# Altium project timer.PrjPcb
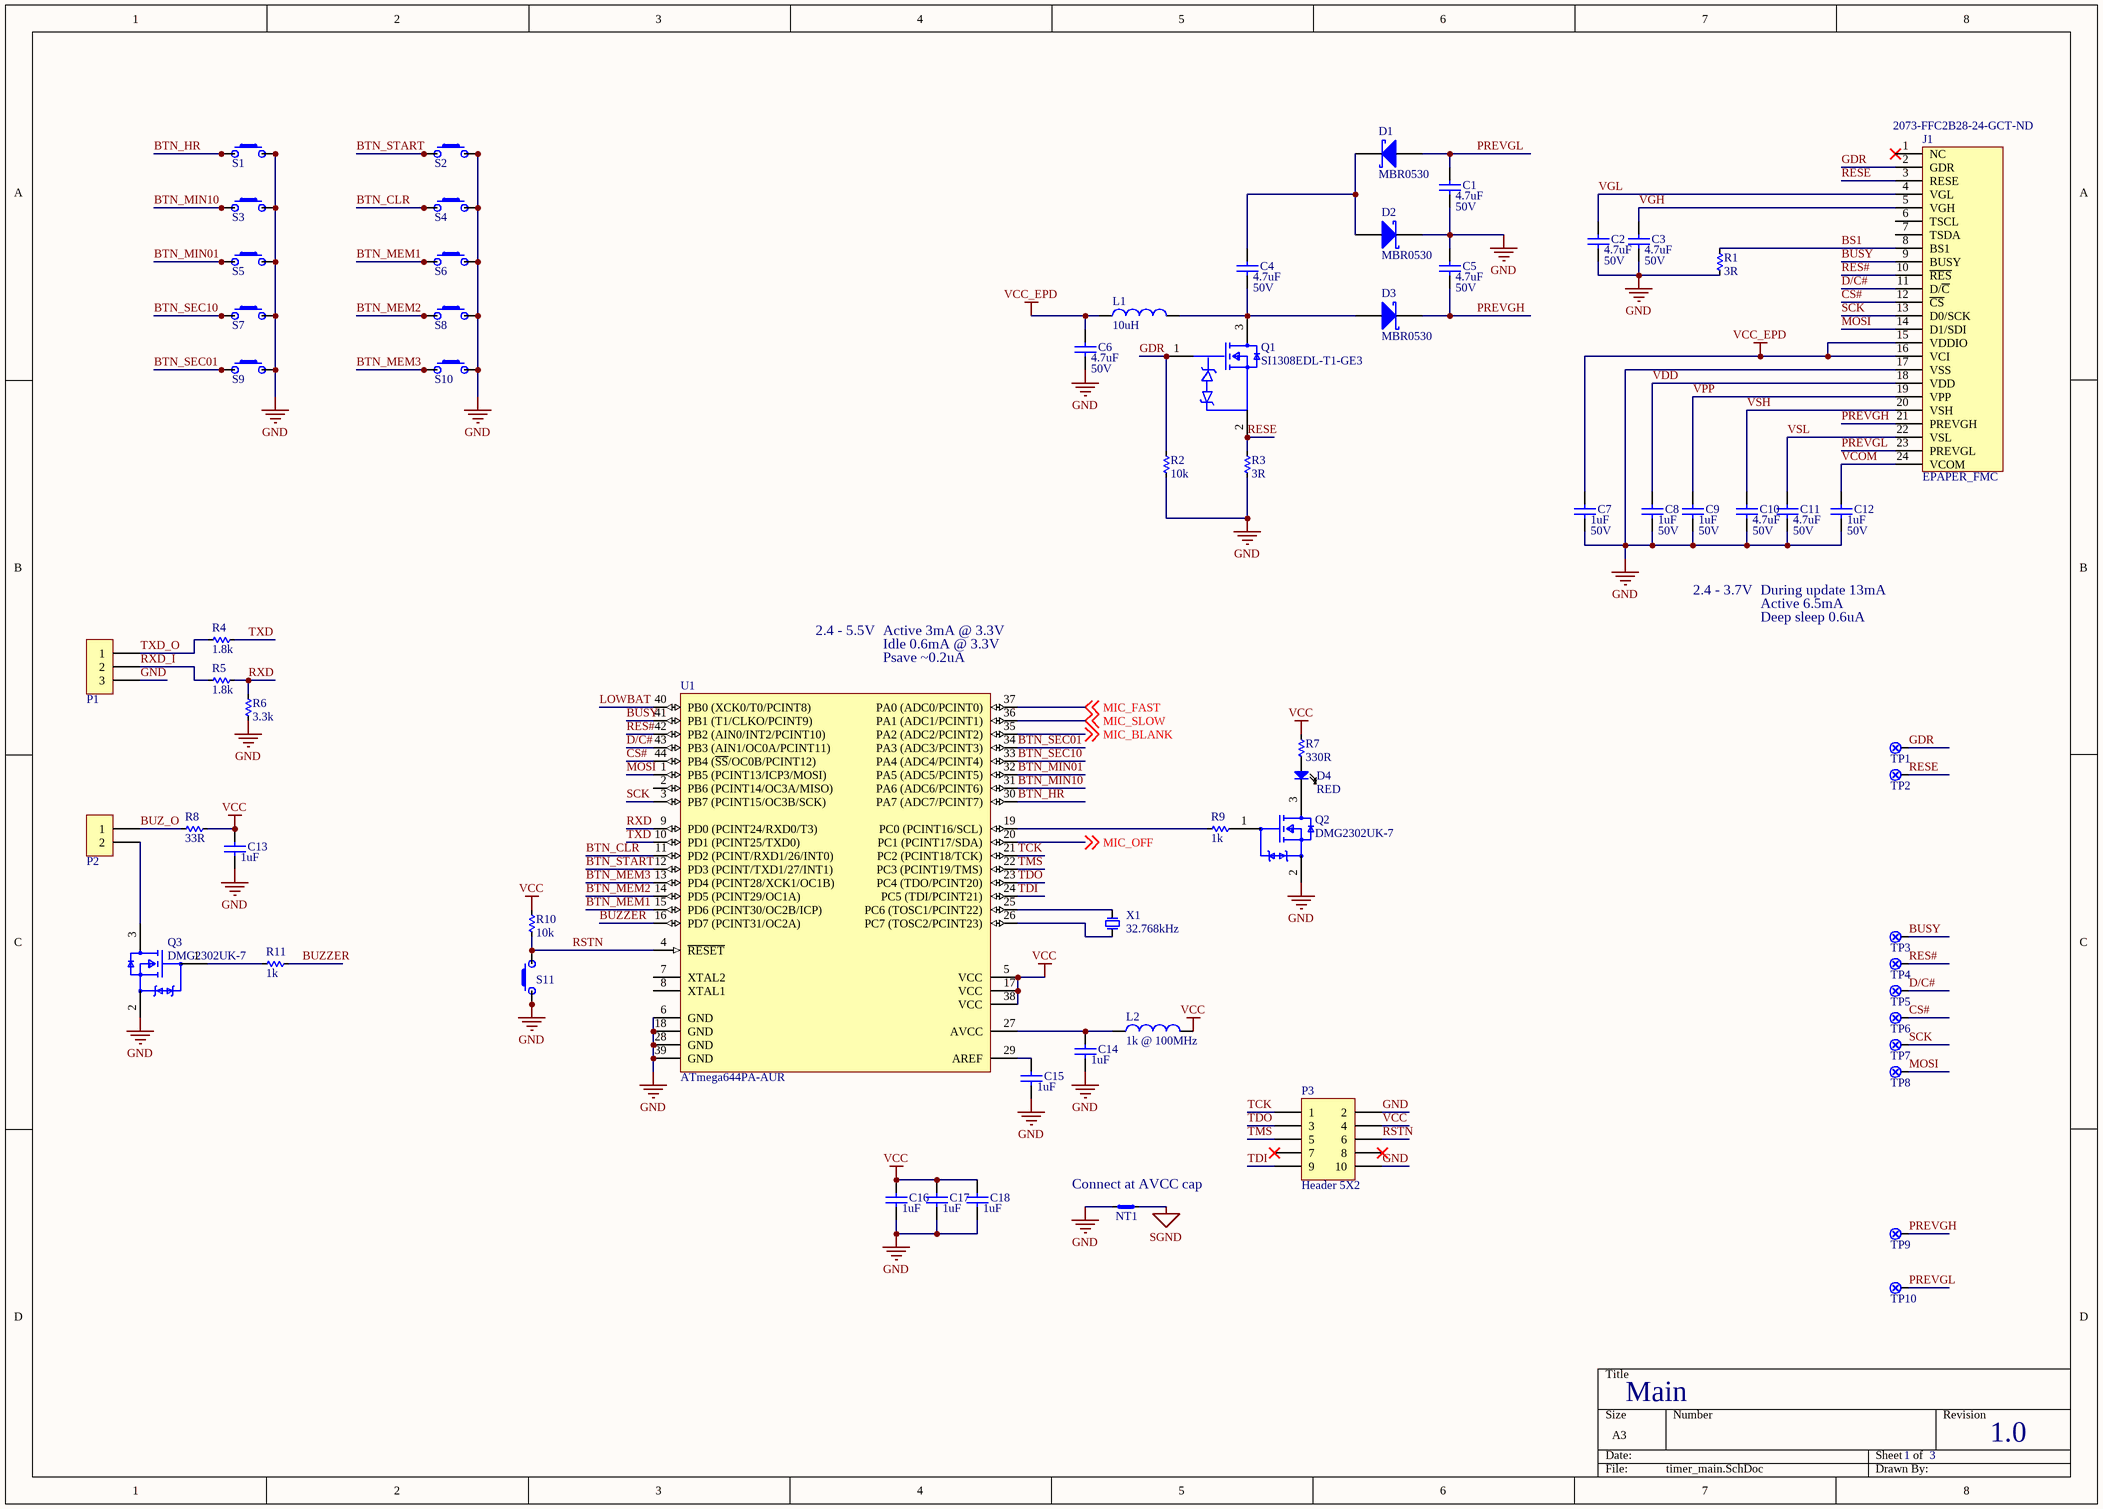
[diagram p0: timer_main.SchDoc]
Version: 1.0
3 sheets, 158 parts. Net scope: global (net labels, ports and power ports of the same name join across sheets).
Board file: timer.PcbDoc
Sheets:
  timer_main.SchDoc
  timer_power.SchDoc
  timer_mic.SchDoc

## Sheet timer_main.SchDoc
size A3; DocumentNumber: 1; SheetNumber: 1; SheetTotal: 3

### Parts
C1  value 4.7uF  Voltage: 50V  [C0805/2012]  (hidden comment: CAP)
C2  value 4.7uF  Voltage: 50V  [C0805/2012]  (hidden comment: CAP)
C3  value 4.7uF  Voltage: 50V  [C0805/2012]  (hidden comment: CAP)
C4  value 4.7uF  Voltage: 50V  [C0805/2012]  (hidden comment: CAP)
C5  value 4.7uF  Voltage: 50V  [C0805/2012]  (hidden comment: CAP)
C6  value 4.7uF  Voltage: 50V  [C0805/2012]  (hidden comment: CAP)
C7  value 1uF  Voltage: 50V  [C0603/1608]  (hidden comment: CAP)
C8  value 1uF  Voltage: 50V  [C0603/1608]  (hidden comment: CAP)
C9  value 1uF  Voltage: 50V  [C0603/1608]  (hidden comment: CAP)
C10  value 4.7uF  Voltage: 50V  [C0805/2012]  (hidden comment: CAP)
C11  value 4.7uF  Voltage: 50V  [C0805/2012]  (hidden comment: CAP)
C12  value 1uF  Voltage: 50V  [C0603/1608]  (hidden comment: CAP)
C13  value 1uF  [C0603/1608]  (hidden comment: CAP)
C14  value 1uF  [C0603/1608]  (hidden comment: CAP)
C15  value 1uF  [C0603/1608]  (hidden comment: CAP)
C16  value 1uF  [C0603/1608]  (hidden comment: CAP)
C17  value 1uF  [C0603/1608]  (hidden comment: CAP)
C18  value 1uF  [C0603/1608]  (hidden comment: CAP)
D1  MBR0530  [FAIR-SOD123-2_V]
D2  MBR0530  [FAIR-SOD123-2_V]
D3  MBR0530  [FAIR-SOD123-2_V]
D4  value RED  [0603/1608_P]  (hidden comment: LED)
J1  EPAPER_FMC  Supplier Part Number 1: 2073-FFC2B28-24-GCT-ND  [FFC2B28-24-G REV]
L1  value 10uH  [IND4x4mm]  (hidden comment: IND)
L2  value 1k @ 100MHz  [R0603/1608]  (hidden comment: FERRITE)
NT1  NET_TIE2  [NT2_0.5mm]  (value not drawn)  (net tie, no BOM)
P1  SIL3  [PINS-3]  (value not drawn)
P2  SIL2  [PINS-2]  (value not drawn)
P3  Header 5X2  [HDR2X5]
Q1  SI1308EDL-T1-GE3  [FP-S-03946-MFG]
Q2  DMG2302UK-7  [FP-SOT23-MFG]
Q3  DMG2302UK-7  [FP-SOT23-MFG]
R1  value 3R  [R0603/1608]  (hidden comment: RES)
R2  value 10k  [R0603/1608]  (hidden comment: RES)
R3  value 3R  [R0603/1608]  (hidden comment: RES)
R4  value 1.8k  [R0603/1608]  (hidden comment: RES)
R5  value 1.8k  [R0603/1608]  (hidden comment: RES)
R6  value 3.3k  [R0603/1608]  (hidden comment: RES)
R7  value 330R  [R0603/1608]  (hidden comment: RES)
R8  value 33R  [R0603/1608]  (hidden comment: RES)
R9  value 1k  [R0603/1608]  (hidden comment: RES)
R10  value 10k  [R0603/1608]  (hidden comment: RES)
R11  value 1k  [R0603/1608]  (hidden comment: RES)
S1  SW  [SW-PTS645-SMT]  (value not drawn)
S2  SW  [SW-PTS645-SMT]  (value not drawn)
S3  SW  [SW-PTS645-SMT]  (value not drawn)
S4  SW  [SW-PTS645-SMT]  (value not drawn)
S5  SW  [SW-PTS645-SMT]  (value not drawn)
S6  SW  [SW-PTS645-SMT]  (value not drawn)
S7  SW  [SW-PTS645-SMT]  (value not drawn)
S8  SW  [SW-PTS645-SMT]  (value not drawn)
S9  SW  [SW-PTS645-SMT]  (value not drawn)
S10  SW  [SW-PTS645-SMT]  (value not drawn)
S11  SW  [SW-PTS645-SMT]  (value not drawn)
TP1  TP  [TP-1.0]  (value not drawn)  (no BOM)
TP2  TP  [TP-1.0]  (value not drawn)  (no BOM)
TP3  TP  [TP-1.0]  (value not drawn)  (no BOM)
TP4  TP  [TP-1.0]  (value not drawn)  (no BOM)
TP5  TP  [TP-1.0]  (value not drawn)  (no BOM)
TP6  TP  [TP-1.0]  (value not drawn)  (no BOM)
TP7  TP  [TP-1.0]  (value not drawn)  (no BOM)
TP8  TP  [TP-1.0]  (value not drawn)  (no BOM)
TP9  TP  [TP-1.0]  (value not drawn)  (no BOM)
TP10  TP  [TP-1.0]  (value not drawn)  (no BOM)
U1  ATmega644PA-AUR  [44A_N]
X1  value 32.768kHz  [CMR200T]  (hidden comment: XTAL)

### Nets
GND: C1.1 C2.1 C3.1 C5.2 C6.1 C7.1 C8.1 C9.1 C10.1 C11.1 C12.1 C13.1 C14.1 C15.1 C16.1 C17.1 C18.1 D2.2(K) J1.17(VSS) NT1.1 P1.3 P3.2 P3.10 Q2.2(S) Q3.2(S) R1.2 R2.2 R3.2 R6.2 S1.3 S1.4 S2.3 S2.4 S3.3 S3.4 S4.3 S4.4 S5.3 S5.4 S6.3 S6.4 S7.3 S7.4 S8.3 S8.4 S9.3 S9.4 S10.3 S10.4 S11.1 S11.2 U1.6(GND) U1.18(GND) U1.28(GND) U1.39(GND)
SGND: NT1.2
VCC: C13.2 C16.2 C17.2 C18.2 L2.2 P3.4 R7.1 R8.2 R10.1 U1.5(VCC) U1.17(VCC) U1.38(VCC)
VCC_EPD: C6.2 C7.2 J1.15(VDDIO) J1.16(VCI) L1.1
BS1: J1.8(BS1) R1.1
BTN_CLR: S4.1 S4.2 U1.11(PD2_(PCINT/RXD1/26/INT0))
BTN_HR: S1.1 S1.2 U1.30(PA7_(ADC7/PCINT7))
BTN_MEM1: S6.1 S6.2 U1.15(PD6_(PCINT30/OC2B/ICP))
BTN_MEM2: S8.1 S8.2 U1.14(PD5_(PCINT29/OC1A))
BTN_MEM3: S10.1 S10.2 U1.13(PD4_(PCINT28/XCK1/OC1B))
BTN_MIN01: S5.1 S5.2 U1.32(PA5_(ADC5/PCINT5))
BTN_MIN10: S3.1 S3.2 U1.31(PA6_(ADC6/PCINT6))
BTN_SEC01: S9.1 S9.2 U1.34(PA3_(ADC3/PCINT3))
BTN_SEC10: S7.1 S7.2 U1.33(PA4_(ADC4/PCINT4))
BTN_START: S2.1 S2.2 U1.12(PD3_(PCINT/TXD1/27/INT1))
BUSY: J1.9(BUSY) TP3.0 U1.41(PB1_(T1/CLKO/PCINT9))
BUZ_O: P2.1 R8.1
BUZZER: R11.2 U1.16(PD7_(PCINT31/OC2A))
CS#: J1.12(~{CS}) TP6.0 U1.44(PB4_(~{SS}/OC0B/PCINT12))
D/C#: J1.11(D/~{C}) TP5.0 U1.43(PB3_(AIN1/OC0A/PCINT11))
GDR: J1.2(GDR) Q1.1(G) R2.1 TP1.0
LOWBAT: U1.40(PB0_(XCK0/T0/PCINT8))
MIC_BLANK: U1.35(PA2_(ADC2/PCINT2)) ; off-sheet MIC_BLANK
MIC_FAST: U1.37(PA0_(ADC0/PCINT0)) ; off-sheet MIC_FAST
MIC_OFF: U1.20(PC1_(PCINT17/SDA)) ; off-sheet MIC_OFF
MIC_SLOW: U1.36(PA1_(ADC1/PCINT1)) ; off-sheet MIC_SLOW
MOSI: J1.14(D1/SDI) TP8.0 U1.1(PB5_(PCINT13/ICP3/MOSI))
PREVGH: C5.1 D3.2(K) J1.21(PREVGH) TP9.0
PREVGL: C1.2 D1.1(A) J1.23(PREVGL) TP10.0
RES#: J1.10(~{RES}) TP4.0 U1.42(PB2_(AIN0/INT2/PCINT10))
RESE: J1.3(RESE) Q1.2(S) R3.1 TP2.0
RSTN: P3.6 R10.2 S11.3 S11.4 U1.4(~{RESET})
RXD: R5.2 R6.1 U1.9(PD0_(PCINT24/RXD0/T3))
RXD_I: P1.2 R5.1
SCK: J1.13(D0/SCK) TP7.0 U1.3(PB7_(PCINT15/OC3B/SCK))
TCK: P3.1 U1.21(PC2_(PCINT18/TCK))
TDI: P3.9 U1.24(PC5_(TDI/PCINT21))
TDO: P3.3 U1.23(PC4_(TDO/PCINT20))
TMS: P3.5 U1.22(PC3_(PCINT19/TMS))
TXD: R4.2 U1.10(PD1_(PCINT25/TXD0))
TXD_O: P1.1 R4.1
VCOM: C12.2 J1.24(VCOM)
VDD: C8.2 J1.18(VDD)
VGH: C3.2 J1.5(VGH)
VGL: C2.2 J1.4(VGL)
VPP: C9.2 J1.19(VPP)
VSH: C10.2 J1.20(VSH)
VSL: C11.2 J1.22(VSL)
NetC4_1: C4.1 D3.1(A) L1.2 Q1.3(D)
NetC4_2: C4.2 D1.2(K) D2.1(A)
NetC14_2: C14.2 L2.1 U1.27(AVCC)
NetC15_2: C15.2 U1.29(AREF)
NetD4_1: D4.1 R7.2
NetD4_2: D4.2 Q2.3(D)
NetP2_2: P2.2 Q3.3(D)
NetQ2_1: Q2.1(G) R9.2
NetQ3_1: Q3.1(G) R11.1
NetR9_1: R9.1 U1.19(PC0_(PCINT16/SCL))
NetU1_25: U1.25(PC6_(TOSC1/PCINT22)) X1.2
NetU1_26: U1.26(PC7_(TOSC2/PCINT23)) X1.1

Not connected (* = marked no-connect by the designer): J1 1(NC)* 6(TSCL) 7(TSDA); P3 7* 8*; U1 2(PB6_(PCINT14/OC3A/MISO)) 7(XTAL2) 8(XTAL1)

### Notes on the sheet
- 2.4 - 5.5V
- Active 3mA @ 3.3V
- Idle 0.6mA @ 3.3V
- 2.4 - 3.7V
- Active 6.5mA
- Deep sleep 0.6uA
- During update 13mA
- (near U1) Psave ~0.2uA
- (near NT1) Connect at AVCC cap
- Main

### Library data of the parts
C1-C12 = CAP: Capacitor; Tolerance: x%; Type: X5R/X7R
C13-C18 = CAP: Capacitor; Tolerance: x%; Voltage: 6.3V; Type: X5R/X7R
D1-D3 = CMP-2000-05113-1: Diode Schottky 30V 0.5A 2-Pin SOD-123 T/R; Manufacturer: Fairchild; Speed: FastRecovery=200mA(Io); Voltage - Forward (Vf) (Max) @ If: 430mV@500mA; Online Catalog: SchottkyDiode; Current - Reverse Leakage @ Vr: 130µA@30V; Current - Average Rectified (Io): 500mA; Other Names: MBR0530CT; Reverse Recovery Time (trr): -; Category: DiscreteSemiconductorProducts; Package / Case: SOD-123; Capacitance @ Vr, F: -; Operating Temperature - Junction: -65degC~125degC; Standard Package: 1; Packaging: CutTape(CT); Family: Diodes,Rectifiers-Single; Diode Type: Schottky; Series: -; Datasheet Version: Rev. 1.1.0, 10/2014; Supplier Device Package: SOD-123; Mounting Type: SurfaceMount; Datasheet URL: https://www.fairchildsemi.com/datasheets/MB/MBR0530.pdf; Manufacturer URL: https://www.fairchildsemi.com/; Voltage - DC Reverse (Vr) (Max): 30V
J1 = EPAPER_FMC: FMC connector for epaper display from Dailan Good Display; Supplier 1: Digi-Key
L1 L2 = IND: Inductor
NT1 = NET_TIE2: Link between nets
P1 = SIL3: SIL package, 3 pins
P2 = SIL2: SIL package, 2 pins
P3 = Header 5X2: Header, 5-Pin, Dual row; LatestRevisionDate: 17-Jul-2002; LatestRevisionNote: Re-released for DXP Platform.; Publisher: Altium Limited
Q1 = CMP-02550-000099-1: MOSFET N-CH 30V 1.4A SC-70-3; Manufacturer: Vishay; Threshold Vgs Max: 1.5V; Turn On Delay Time: 2ns; Gate Charge At Vgs: 2.7nC @ 10V; Typ Forward Diode Voltage: 0.8V; Gate To Source Voltage: 12V; Max Junction Temp: +150°C; Pulse Drain Current: 6A; Threshold Vgs Min: 0.6V; Number Of Channels: 1; Transconductance: 5S; Continuous Drain Current: 1.5A; Rthja Max: 250°C/W; Turn Off Delay Time: 8ns; Power Dissipation: 0.4W; Input Capacitace At Vds: 105pF @ 15V; Max Forward Diode Voltage: 1.2V; Reverse Recovery Charge: 3nC; Depletion Mode: False; Drain To Source Resistance: 0.11Ω; Height: 1.1mm; Lead Free: Yes; Ipc Land Pattern Name: SOT65P210X100-3; Drain To Source Voltage: 30V; Mouser Description: MOSFET 30V 1.5A; Temperature Range Low: -55°C; ComponentLink2URL: http://www.vishay.com/docs/63399/si1308edl.pdf; Package: S-03946; RoHS: TRUE; Device Class L1: Discrete Semiconductors; Manufacturer Part Number: SI1308EDL-T1-GE3; Category: Trans; Number Of N Channels: 1; Temperature Range High: +150°C; Octopart: https://octopart.com/si1308edl-t1-ge3-vishay-45284459; Automotive: No; Digikey Description: MOSFET N-CH 30V 1.4A SC-70-3; ComponentLink2Description: Datasheet; Device Class L3: MOSFETs; Reverse Recovery Time: 8ns; Device Class L2: Transistors; Drain To Source Breakdown Voltage: 30V; Temperature: -55°C to +150°C
Q2 Q3 = CMP-12801-000001-1: MOSFET N-CH 20V 2.8A SOT23; Manufacturer: Diodes Inc.; Reverse Recovery Time: 5.3ns; Gate Charge At Vgs: 2.8nC @ 10V; Turn On Delay Time: 0.6ns; Pulse Drain Current: 12A; Max Forward Diode Voltage: 1.2V; Reverse Recovery Charge: 0.5nC; Automotive Grade: Grade 0; Threshold Vgs Min: 0.3V; Number Of N Channels: 1; Standoff Height: 0.013mm; Typ Forward Diode Voltage: 0.7V; Drain To Source Resistance: 61mΩ; Rthja Max: 192°C/W; Max Junction Temp: +150°C; Input Capacitace At Vds: 130pF @ 10V; Threshold Vgs Max: 1V; Turn Off Delay Time: 4.2ns; Depletion Mode: False; Gate To Source Voltage: 12V; Power Dissipation: 0.66W; Device Class L1: Discrete Semiconductors; Footprint Url: https://www.diodes.com/assets/Package-Files/SOT23.pdf; Lead Free: Yes; Manufacturer Part Number: DMG2302UK-7; Temperature Range High: +150°C; Drain To Source Voltage: 20V; Category: Trans; Digikey Description: MOSFET N-CH 20V 2.8A SOT23; RoHS: TRUE; Device Class L2: Transistors; Height: 1.1mm; Automotive: Yes; Package: SOT23; Drain To Source Breakdown Voltage: 20V; Continuous Drain Current: 2.8A; ComponentLink2Description: Datasheet; Device Class L3: MOSFETs; Octopart: https://octopart.com/dmg2302uk-7-diodes+inc.-73850182; Temperature Range Low: -55°C; Temperature: -55°C to +150°C; Number Of Channels: 1; ComponentLink2URL: https://www.diodes.com/assets/Datasheets/DMG2302UK.pdf
R1-R11 = RES: Resistor; Tolerance: x%
S1-S11 = SW-PB: Switch; Supplier 1: Digi-Key; Supplier Part Number 1: CKN9088CT-ND
TP1-TP10 = TP: Test point
U1 = CMP-0095-00266-2: 8-bit AVR Microcontroller, 64KB Flash, 2KB EEPROM, 4KB SRAM, 44-pin TQFP, Industrial Grade (-40°C to 85°C), Reel; ComponentLink3URL: http://www.atmel.com/dyn/resources/prod_documents/8272S.pdf; ComponentLink2Description: ATmega164A/164PA/324A/324PA/644A/644PA/1284/1284P Datasheet; ComponentLink2URL: http://www.atmel.com/dyn/resources/prod_documents/doc8272.pdf; PackageVersion: revC, Oct-2010; Code_JEDEC: MS-026-ACB; DatasheetVersion: revC, Jun-2011; PackageDescription: 44-Pin Plastic Thin Profile Quad Flat Pack, 10 x 10 x 1.0 mm Body, 0.8 mm Pitch (TQFP); ComponentLink1URL: http://www.atmel.com/; PackageReference: 44A; ComponentLink3Description: ATmega164A/164PA/324A/324PA/644A/644PA/1284/1284P Summary; ComponentLink1Description: Manufacturer URL; RevisionNote: DatasheetVersion & PackageVersion updated. Sch pin names updated. URLs added.
X1 = XTAL: Crystal

## Sheet timer_power.SchDoc
size A3; DocumentNumber: 2; SheetNumber: 2; SheetTotal: 3
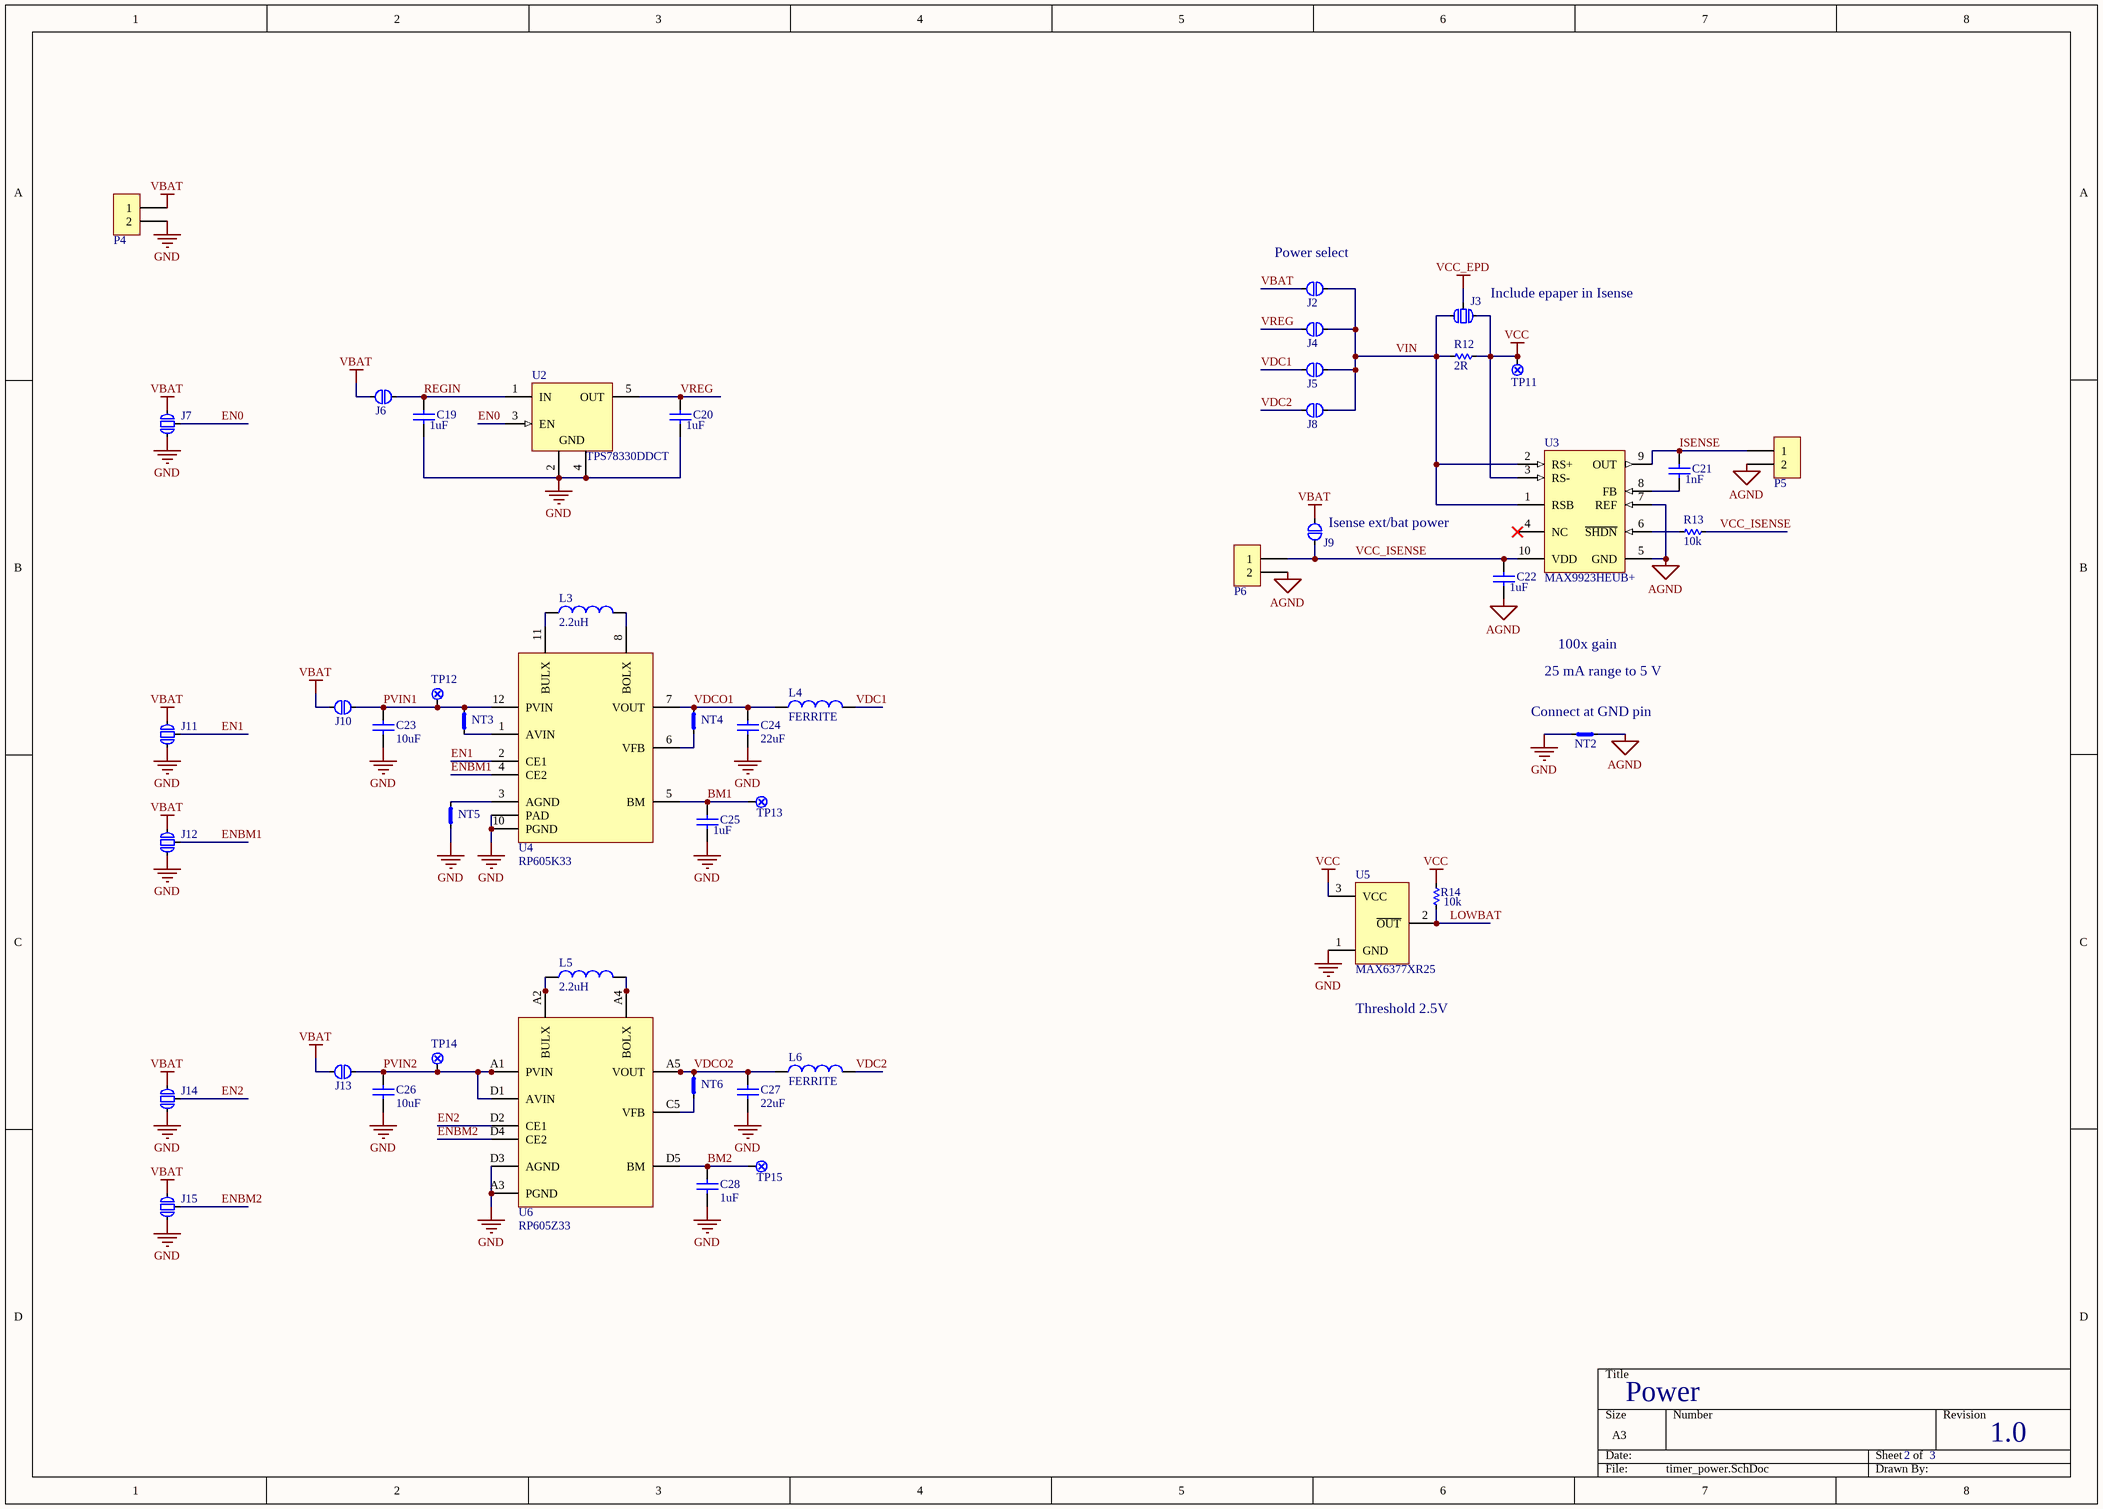
[diagram p1: timer_power.SchDoc]

### Parts
C19  value 1uF  [C0603/1608]  (hidden comment: CAP)
C20  value 1uF  [C0603/1608]  (hidden comment: CAP)
C21  value 1nF  [C0603/1608]  (hidden comment: CAP)
C22  value 1uF  [C0603/1608]  (hidden comment: CAP)
C23  value 10uF  [C0805/2012]  (hidden comment: CAP)
C24  value 22uF  [C0805/2012]  (hidden comment: CAP)
C25  value 1uF  [C0603/1608]  (hidden comment: CAP)
C26  value 10uF  [C0805/2012]  (hidden comment: CAP)
C27  value 22uF  [C0805/2012]  (hidden comment: CAP)
C28  value 1uF  [C0603/1608]  (hidden comment: CAP)
J2  SEL2  [JMP2]  (value not drawn)  (no BOM)
J3  SEL3  [JMP3]  (value not drawn)  (no BOM)
J4  SEL2  [JMP2]  (value not drawn)  (no BOM)
J5  SEL2  [JMP2]  (value not drawn)  (no BOM)
J6  SEL2  [JMP2]  (value not drawn)  (no BOM)
J7  SEL3  [JMP3]  (value not drawn)  (no BOM)
J8  SEL2  [JMP2]  (value not drawn)  (no BOM)
J9  SEL2  [JMP2]  (value not drawn)  (no BOM)
J10  SEL2  [JMP2]  (value not drawn)  (no BOM)
J11  SEL3  [JMP3]  (value not drawn)  (no BOM)
J12  SEL3  [JMP3]  (value not drawn)  (no BOM)
J13  SEL2  [JMP2]  (value not drawn)  (no BOM)
J14  SEL3  [JMP3]  (value not drawn)  (no BOM)
J15  SEL3  [JMP3]  (value not drawn)  (no BOM)
L3  value 2.2uH  [IND3x3mm]  (hidden comment: IND)
L4  value FERRITE  [R0603/1608]  (hidden comment: IND)
L5  value 2.2uH  [IND3x3mm]  (hidden comment: IND)
L6  value FERRITE  [R0603/1608]  (hidden comment: IND)
NT2  NET_TIE  [NT2_0.5mm]  (value not drawn)  (net tie, no BOM)
NT3  NET_TIE  [NT2_0.5mm]  (value not drawn)  (net tie, no BOM)
NT4  NET_TIE  [NT2_0.5mm]  (value not drawn)  (net tie, no BOM)
NT5  NET_TIE  [NT2_0.5mm]  (value not drawn)  (net tie, no BOM)
NT6  NET_TIE  [NT2_0.5mm]  (value not drawn)  (net tie, no BOM)
P4  SIL2  [PINS-2]  (value not drawn)
P5  SIL2  [PINS-2]  (value not drawn)
P6  SIL2  [PINS-2]  (value not drawn)
R12  value 2R  [R0805/2012]  (hidden comment: RES)
R13  value 10k  [R0603/1608]  (hidden comment: RES)
R14  value 10k  [R0603/1608]  (hidden comment: RES)
TP11  TP  [TP-1.0]  (value not drawn)  (no BOM)
TP12  TP  [TP-1.0]  (value not drawn)  (no BOM)
TP13  TP  [TP-1.0]  (value not drawn)  (no BOM)
TP14  TP  [TP-1.0]  (value not drawn)  (no BOM)
TP15  TP  [TP-1.0]  (value not drawn)  (no BOM)
U2  TPS78330DDCT  [DDC0005A_L]
U3  MAX9923HEUB+  [MAXM-U10+2_N]
U4  RP605K33  [DFN(PLP)2730-12]
U5  MAX6377XR25  [SC70-3]
U6  RP605Z33  [WLCSP-20-P3]

### Nets
AGND: C22.1 NT2.2 P5.2 P6.2 U3.5(GND) U3.7(REF)
GND: C19.1 C20.1 C23.1 C24.1 C25.1 C26.1 C27.1 C28.1 J7.1 J11.1 J12.1 J14.1 J15.1 NT2.1 NT5.1 P4.2 U2.2(GND) U2.4(GND) U4.0(PAD) U4.9(PGND) U4.10(PGND) U5.1(GND) U6.A3(PGND) U6.B3(PGND) U6.C3(PGND) U6.D3(AGND)
VBAT: J2.1 J6.1 J7.3 J9.2 J10.1 J11.3 J12.3 J13.1 J14.3 J15.3 P4.1
VCC: J3.1 R12.2 R14.1 TP11.0 U3.3(RS-) U5.3(VCC)
VCC_EPD: J3.2
BM1: C25.2 TP13.0 U4.5(BM)
BM2: C28.2 TP15.0 U6.D5(BM)
EN0: J7.2 U2.3(EN)
EN1: J11.2 U4.2(CE1)
EN2: J14.2 U6.D2(CE1)
ENBM1: J12.2 U4.4(CE2)
ENBM2: J15.2 U6.D4(CE2)
ISENSE: C21.2 P5.1 U3.9(OUT)
LOWBAT: R14.2 U5.2(~{OUT})
PVIN1: C23.2 J10.2 NT3.2 TP12.0 U4.12(PVIN)
PVIN2: C26.2 J13.2 TP14.0 U6.A1(PVIN) U6.B1(PVIN) U6.C1(PVIN) U6.D1(AVIN)
REGIN: C19.2 J6.2 U2.1(IN)
VCC_ISENSE: C22.2 J9.1 P6.1 R13.2 U3.10(VDD)
VDC1: J5.1 L4.2
VDC2: J8.1 L6.2
VDCO1: C24.2 L4.1 NT4.2 U4.7(VOUT)
VDCO2: C27.2 L6.1 NT6.2 U6.A5(VOUT) U6.B5(VOUT)
VIN: J2.2 J3.3 J4.2 J5.2 J8.2 R12.1 U3.1(RSB) U3.2(RS+)
VREG: C20.2 J4.1 U2.5(OUT)
NetC21_1: C21.1 U3.8(FB)
NetL3_1: L3.1 U4.11(BULX)
NetL3_2: L3.2 U4.8(BOLX)
NetL5_1: L5.1 U6.A2(BULX) U6.B2(BULX) U6.C2(BULX)
NetL5_2: L5.2 U6.A4(BOLX) U6.B4(BOLX) U6.C4(BOLX)
NetNT3_1: NT3.1 U4.1(AVIN)
NetNT4_1: NT4.1 U4.6(VFB)
NetNT5_2: NT5.2 U4.3(AGND)
NetNT6_1: NT6.1 U6.C5(VFB)
NetR13_1: R13.1 U3.6(~{SHDN})

Not connected (* = marked no-connect by the designer): U3 4(NC)*

### Notes on the sheet
- (near J2) Power select
- (near J3) Include epaper in Isense
- (near J9) Isense ext/bat power
- 100x gain
- (near NT2) Connect at GND pin
- 25 mA range to 5 V
- (near U5) Threshold 2.5V
- Power

### Library data of the parts
C19-C28 = CAP: as C13 on sheet timer_main
J2 J4-J6 J8-J10 J13 = SEL2: solderable jumper
J3 J7 J11 J12 J14 J15 = SEL3: solderable jumper
L3-L6 = IND: Inductor
NT2-NT6 = NET_TIE2: Link between nets
P4-P6 = SIL2: SIL package, 2 pins
R12-R14 = RES: Resistor; Tolerance: x%
TP11-TP15 = TP: Test point
U2 = CMP-0394-01077-2: Single Output LDO, 150 mA, Fixed 3 V Output, 2.2 to 5.5 V Input, with Ultra-Low IQ, 5-pin SOT (DDC), -40 to 105 degC, Green (RoHS & no Sb/Br); Manufacturer: Texas Instruments; Vout Adj(Min)(V): 3; SubFamily: Single Channel LDO; Iout(Max)(A): 0.15; Vdo(Typ)(mV): 130; Rating: Catalog; Iq(Typ)(mA): 0.0005; Vin(Min)(V): 2.2; Vin(Max)(V): 5.5; PackageDescription: 5-Pin Plastic Small Outline, Body 2.9 x 1.6 mm, 0.95 mm Pitch; ComponentLink1Description: Manufacturer URL; Code_JEDEC: MO-193; PackageVersion: 4204403-2/E; ComponentLink1URL: http://www.ti.com/; Mounting Technology: Surface Mount; ComponentLink3URL: http://www.ti.com/litv/pdf/mpds123d; ComponentLink2Description: Datasheet; ComponentLink2URL: http://www.ti.com/general/docs/lit/getliterature.tsp?genericPartNumber=TPS78330&fileType=pdf; DatasheetVersion: SBVS133; Accuracy(%): 3; ComponentLink3Description: Package Specification; Vout Adj(Max)(V): 3; PartNumber: TPS78330DDCT; PackageReference: DDC0005A; Fixed Output Options(V): 3; Eco-Plan: Green (RoHS & no Sb/Br)
U3 = CMP-0252-00274-1: Ultra-Precision, High-Side Current-Sense Amplifier with Fixed Gain, 100 V / V Gain, -40 to 85 degC, 10-Pin SOP (U10+2), Pb-Free; Bi-Dir. Curr. Sense: Yes; Gain: 25 V/V, 100 V/V ,250 V/V; PartNumber: MAX9923HEUB+; Code_JEDEC: MO-187; ComponentLink3URL: http://pdfserv.maximintegrated.com/package_dwgs/21-0061.PDF; ComponentLink2URL: http://datasheets.maximintegrated.com/en/ds/MAX9922-MAX9923.pdf; PackageDescription: 10-Pin Micro-MAX, Thin Shrink Small-Outline (U10+2), Body 3 x 3 mm, Pitch 0.5 mm; ComponentLink2Description: Datasheet; PackageReference: U10+2; ComponentLink3Description: Package Specification; Mounting Technology: Surface Mount; ComponentLink1Description: Manufacturer URL; PackageVersion: Rev. L, 07/2008; ComponentLink1URL: http://www.maximintegrated.com/; DatasheetVersion: Rev. 1
U4 = RP605xK: 300mA Ultra-low Power Buck Boost DC/DC Converter with Battery Monitor, DFN-12 package
U5 = MAX637x: Ultra-Low-Power Voltage Detector
U6 = RP605xZ: 300mA Ultra-low Power Buck Boost DC/DC Converter with Battery Monitor, WLCSP-20 package

## Sheet timer_mic.SchDoc
size A3; DocumentNumber: 3; SheetNumber: 3; SheetTotal: 3
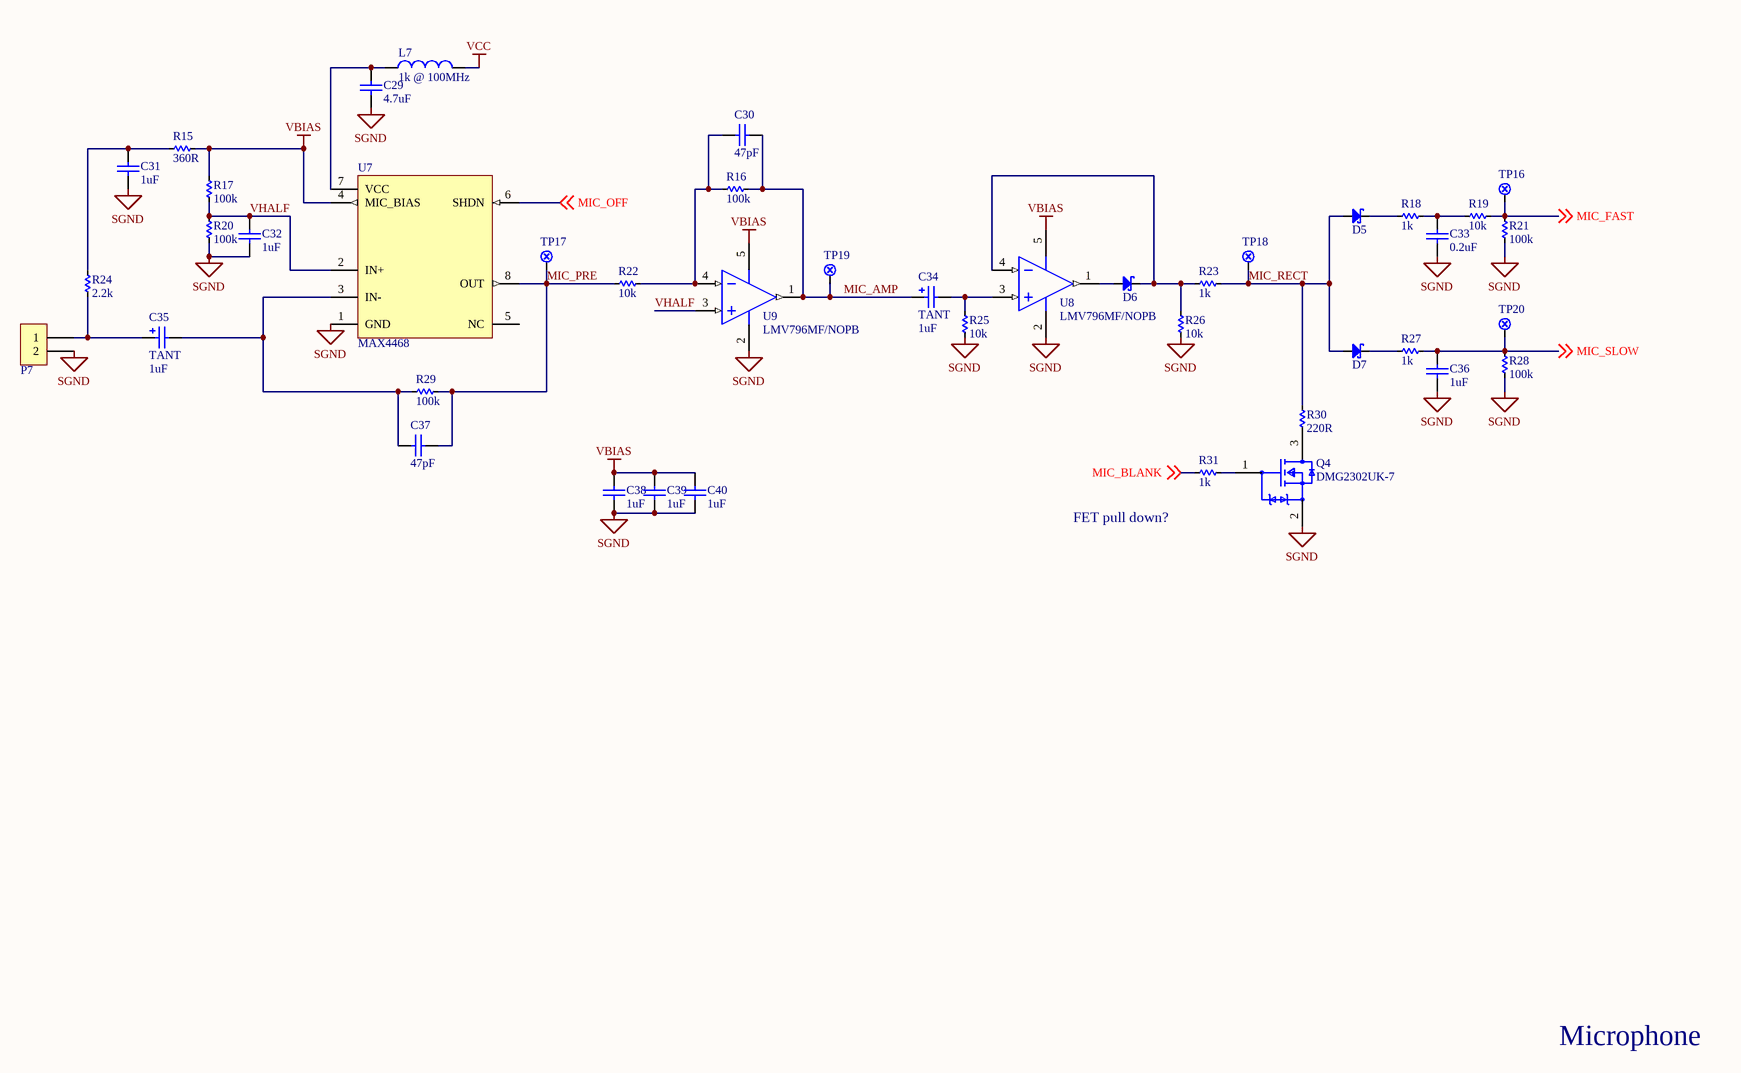
[diagram p2: timer_mic.SchDoc]

### Parts
C29  value 4.7uF  [C0805/2012]  (hidden comment: CAP)
C30  value 47pF  [C0603/1608]  (hidden comment: CAP)
C31  value 1uF  [C0603/1608]  (hidden comment: CAP)
C32  value 1uF  [C0603/1608]  (hidden comment: CAP)
C33  value 0.2uF  [C0603/1608]  (hidden comment: CAP)
C34  value 1uF  Type: TANT  [CP0805/2012]  (hidden comment: POLCAP)
C35  value 1uF  Type: TANT  [CP0805/2012]  (hidden comment: POLCAP)
C36  value 1uF  [C0603/1608]  (hidden comment: CAP)
C37  value 47pF  [C0603/1608]  (hidden comment: CAP)
C38  value 1uF  [C0603/1608]  (hidden comment: CAP)
C39  value 1uF  [C0603/1608]  (hidden comment: CAP)
C40  value 1uF  [C0603/1608]  (hidden comment: CAP)
D5  DIODE_SCHOTTKY  [SOD-123]  (value not drawn)
D6  DIODE_SCHOTTKY  [SOD-123]  (value not drawn)
D7  DIODE_SCHOTTKY  [SOD-123]  (value not drawn)
L7  value 1k @ 100MHz  [R0603/1608]  (hidden comment: FERRITE)
P7  SIL2  [PINS-2]  (value not drawn)
Q4  DMG2302UK-7  [FP-SOT23-MFG]
R15  value 360R  [R0603/1608]  (hidden comment: RES)
R16  value 100k  [R0603/1608]  (hidden comment: RES)
R17  value 100k  [R0603/1608]  (hidden comment: RES)
R18  value 1k  [R0603/1608]  (hidden comment: RES)
R19  value 10k  [R0603/1608]  (hidden comment: RES)
R20  value 100k  [R0603/1608]  (hidden comment: RES)
R21  value 100k  [R0603/1608]  (hidden comment: RES)
R22  value 10k  [R0603/1608]  (hidden comment: RES)
R23  value 1k  [R0603/1608]  (hidden comment: RES)
R24  value 2.2k  [R0603/1608]  (hidden comment: RES)
R25  value 10k  [R0603/1608]  (hidden comment: RES)
R26  value 10k  [R0603/1608]  (hidden comment: RES)
R27  value 1k  [R0603/1608]  (hidden comment: RES)
R28  value 100k  [R0603/1608]  (hidden comment: RES)
R29  value 100k  [R0603/1608]  (hidden comment: RES)
R30  value 220R  [R0603/1608]  (hidden comment: RES)
R31  value 1k  [R0603/1608]  (hidden comment: RES)
TP16  TP  [TP-1.0]  (value not drawn)  (no BOM)
TP17  TP  [TP-1.0]  (value not drawn)  (no BOM)
TP18  TP  [TP-1.0]  (value not drawn)  (no BOM)
TP19  TP  [TP-1.0]  (value not drawn)  (no BOM)
TP20  TP  [TP-1.0]  (value not drawn)  (no BOM)
U7  MAX4468  [SOT23-8]
U8  LMV796MF/NOPB  [DBV0005A_L]
U9  LMV796MF/NOPB  [DBV0005A_L]

### Nets
SGND: C29.1 C31.1 C32.1 C33.1 C36.1 C38.1 C39.1 C40.1 P7.2 Q4.2(S) R20.2 R21.2 R25.2 R26.2 R28.2 U7.1(GND) U8.2(V-) U9.2(V-)
VBIAS: C38.2 C39.2 C40.2 R15.2 R17.1 U7.4(MIC_BIAS) U8.5(V+) U9.5(V+)
VCC: L7.2
MIC_AMP: C30.2 C34.1 R16.1 TP19.0 U9.1(OUT)
MIC_BLANK: R31.2 ; off-sheet MIC_BLANK
MIC_FAST: R19.1 R21.1 TP16.0 ; off-sheet MIC_FAST
MIC_OFF: U7.6(SHDN) ; off-sheet MIC_OFF
MIC_PRE: C37.1 R22.2 R29.2 TP17.0 U7.8(OUT)
MIC_RECT: D5.2 D7.2 R23.1 R30.1 TP18.0
MIC_SLOW: C36.2 R27.1 R28.1 TP20.0 ; off-sheet MIC_SLOW
VHALF: C32.2 R17.2 R20.1 U7.2(IN+) U9.3(IN+)
NetC29_2: C29.2 L7.1 U7.7(VCC)
NetC30_1: C30.1 R16.2 R22.1 U9.4(IN-)
NetC31_2: C31.2 R15.1 R24.1
NetC33_2: C33.2 R18.1 R19.2
NetC34_2: C34.2 R25.1 U8.3(IN+)
NetC35_1: C35.1 P7.1 R24.2
NetC35_2: C35.2 C37.2 R29.1 U7.3(IN-)
NetD5_1: D5.1 R18.2
NetD6_1: D6.1 R23.2 R26.1 U8.4(IN-)
NetD6_2: D6.2 U8.1(OUT)
NetD7_1: D7.1 R27.2
NetQ4_1: Q4.1(G) R31.1
NetQ4_3: Q4.3(D) R30.2

Not connected (* = marked no-connect by the designer): U7 5(NC)

### Notes on the sheet
- (near R31) FET pull down?
- Microphone

### Library data of the parts
C29 C31-C33 C36 C38-C40 = CAP: as C13 on sheet timer_main
C30 C37 = CAP: Capacitor; Tolerance: x%; Voltage: 6.3V; Type: COG/NPO
C34 C35 = CAP_POL: Capacitor; Voltage: 6.3V; Tolerance: x%
D5-D7 = DIODE_SCHOTTKY: Schottky Diode; Voltage: xV; Value: xA
L7 = IND: Inductor
P7 = SIL2: SIL package, 2 pins
Q4 = CMP-12801-000001-1: as Q2 on sheet timer_main; Device Class L1: Discrete Semiconductors; Footprint Url: https://www.diodes.com/assets/Package-Files/SOT23.pdf; Lead Free: Yes; Manufacturer Part Number: DMG2302UK-7; Temperature Range High: +150°C; Drain To Source Voltage: 20V; Category: Trans; Digikey Description: MOSFET N-CH 20V 2.8A SOT23; RoHS: TRUE; Device Class L2: Transistors; Height: 1.1mm; Automotive: Yes; Package: SOT23; Drain To Source Breakdown Voltage: 20V; Continuous Drain Current: 2.8A; ComponentLink2Description: Datasheet; Device Class L3: MOSFETs; Octopart: https://octopart.com/dmg2302uk-7-diodes+inc.-73850182; Temperature Range Low: -55°C; Temperature: -55°C to +150°C; Number Of Channels: 1; ComponentLink2URL: https://www.diodes.com/assets/Datasheets/DMG2302UK.pdf
R15-R31 = RES: Resistor; Tolerance: x%
TP16-TP20 = TP: Test point
U7 = MAX4468: Low-Cost, Micropower, SOT23-8, Microphone / Preamplifier with Complete Shutdown
U8 U9 = CMP-0055-01076-3: 17 MHz, Low Noise, CMOS Input, 1.8V Operational Amplifiers, 5-pin SOT-23, Pb-Free; Manufacturer: Texas Instruments; PackageTopMarking: AT3A*XTT; PowerWise: Y; PinCount: 5; Package Reference: DBV0005A; PackageDescription: Molded SOT-23, .115 x .063 x .040 in Body, 5 Lead, .0375 in Pitch; RoHS: Y; ComponentLink1Description: Datasheet URL; ComponentLink1URL: http://www.ti.com/general/docs/lit/getliterature.tsp?genericPartNumber=LMV796&fileType=pdf; CompType: Amplifiers

## Nets that join several sheets
GND: timer_main (55 pins), timer_power (26 pins)
SGND: timer_main (NT1.2), timer_mic (18 pins)
VCC: timer_main (12 pins), timer_power (6 pins), timer_mic (L7.2)
VCC_EPD: timer_main (5 pins), timer_power (J3.2)
LOWBAT: timer_main (U1.40), timer_power (R14.2 U5.2)
MIC_BLANK: timer_main (U1.35), timer_mic (R31.2)
MIC_FAST: timer_main (U1.37), timer_mic (R19.1 R21.1 TP16.0)
MIC_OFF: timer_main (U1.20), timer_mic (U7.6)
MIC_SLOW: timer_main (U1.36), timer_mic (C36.2 R27.1 R28.1 TP20.0)